# Altium schematic sheet Sheet2.SchDoc: =GlobalProjectName
size 209 x 297 mm; ApprovedBy: Утвердил; CheckedBy: Проверил; Author: Разработал; SheetNumber: 51; SheetTotal: 66; PageSetup: Record=PageOptions|CenterHorizontal=True|CenterVertical=True|PrintScale=1.00|XCorrection=1.00|YCorrection=1.00|PrintKind=1|BorderSize=5000000|LeftOffset=0|BottomOffset=0|Orientation=2|PaperLength=1000|PaperWidth=1000|Scale=100|PaperSource=15|PrintQuality=1200|MediaType=1|DitherType=10|PaperKind=A3|PrintScaleMode=1; Weight: -; ScaleFactor: -; NormInspection: Норм.Контр.
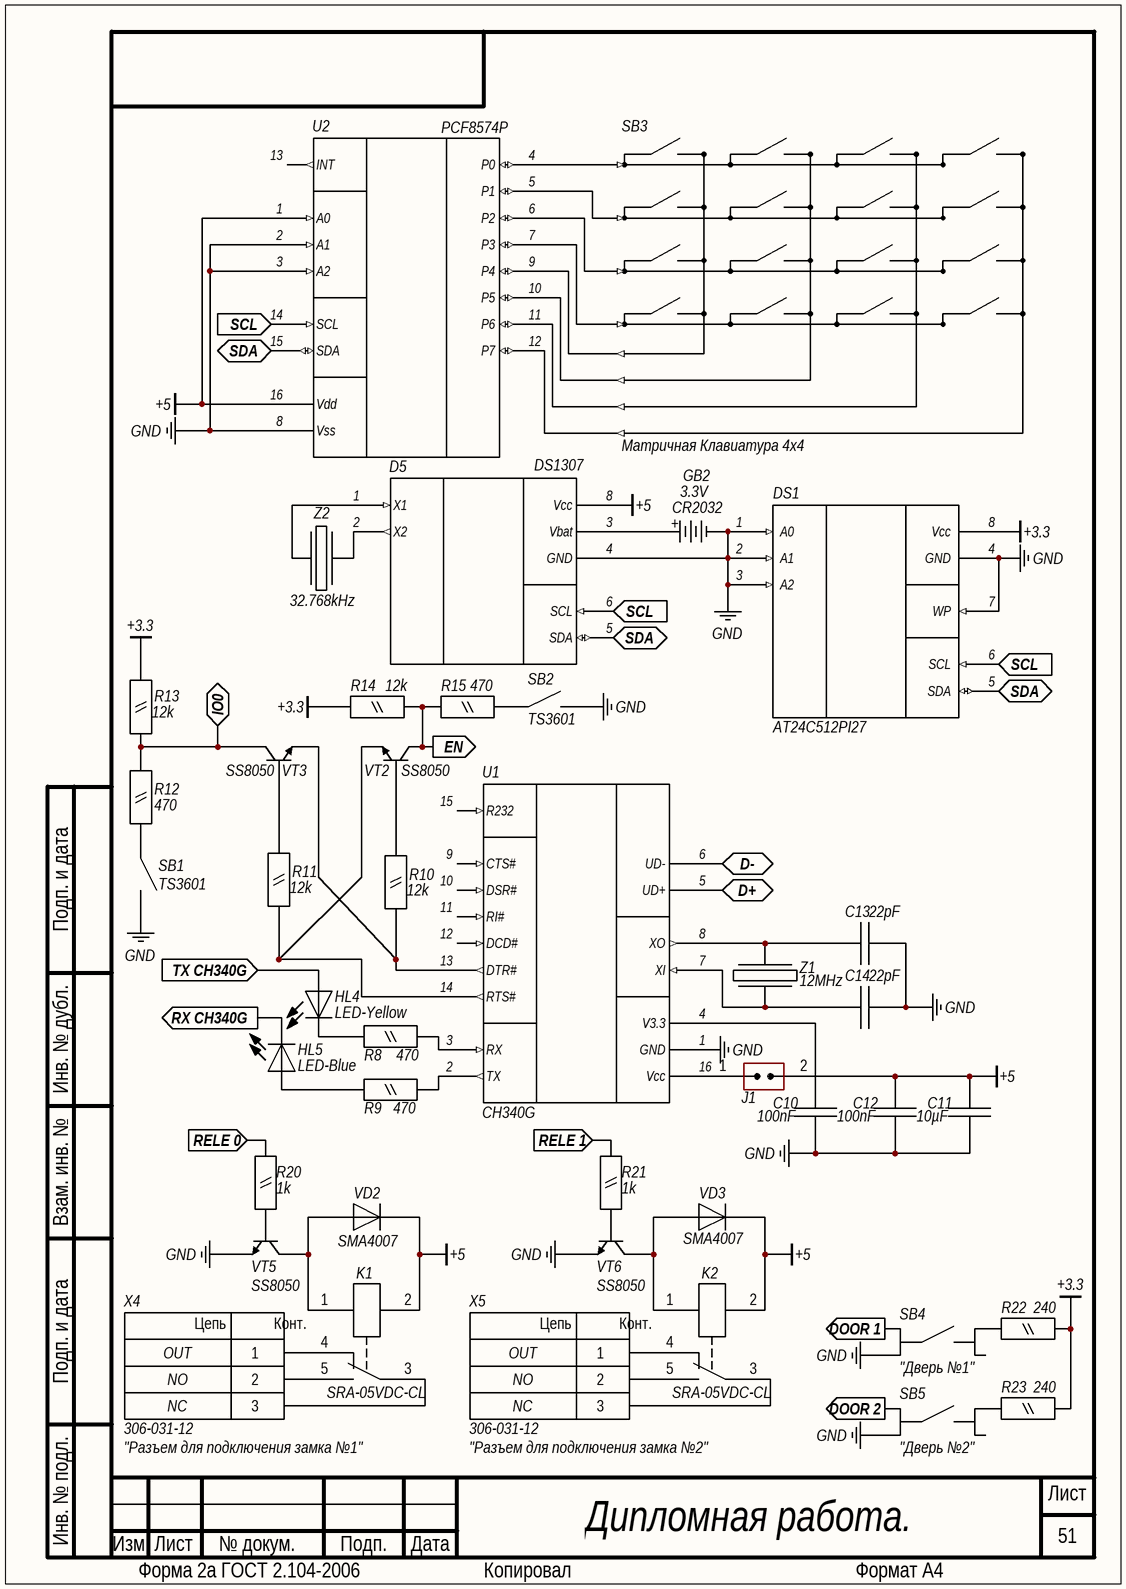
[diagram p0: Sheet2.SchDoc]

## Parts
D5  DS1307  [U DIP-8]
DS1  AT24C512PI27  [U DIP-8]
GB2  3.3V  Case: CR2032  [GB CR2032]
HL4  LED-Yellow  [HL LED SMD 0805]
HL5  LED-Blue  [HL LED SMD 0805]
J1  (no value)  [CON: PLS-2]
K1  SRA-05VDC-CL  [K SRA-05VDC-CL]
K2  SRA-05VDC-CL  [K SRA-05VDC-CL]
R8  470  [R SMD 0805]
R9  470  [R SMD 0805]
R10  12k  [R SMD 0805]
R11  12k  [R SMD 0805]
R12  470  [R SMD 0805]
R13  12k  [R SMD 0805]
R14  12k  [R SMD 0805]
R15  470  [R SMD 0805]
R20  1k  [R SMD 0805]
R21  1k  [R SMD 0805]
R22  240  [R SMD 0805]
R23  240  [R SMD 0805]
SB1  TS3601  [SB 3.5x6]
SB2  TS3601  [SB 3.5x6]
SB3  Матричная Клавиатура 4x4  [X PLS-8]
SB4  "Дверь №1"  [X 301-031-12]
SB5  "Дверь №2"  [X 301-031-12]
U1  CH340G  [U SOIC-16]
U2  PCF8574P  [U DIP-16]
VD2  SMA4007  [VD DO-214AC]
VD3  SMA4007  [VD DO-214AC]
VT2  SS8050  [U SOT-23-3]
VT3  SS8050  [U SOT-23-3]
VT5  SS8050  [U SOT-23-3]
VT6  SS8050  [U SOT-23-3]
X4  306-031-12  CommentText: "Разъем для подключения замка №1"  [X 301-031-12]
X5  306-031-12  CommentText: "Разъем для подключения замка №2"  [X 301-031-12]
Z1  12MHz  [Z HC-49]
Z2  32.768kHz  [Z DT-26]
С10  100nF  [C SMD 0805]
С11  10µF  [C SMD 0805]
С12  100nF  [C SMD 0805]
С13  22pF  [C SMD 0805]
С14  22pF  [C SMD 0805]

## Ports
D+ (bidir), D- (bidir), DOOR 1 (out), DOOR 2 (out), EN (out), IO0 (bidir), RELE 0 (in), RELE 1 (in), RX CH340G (out), SCL (in), SDA (bidir), TX CH340G (in)

## Nets
+3.3: DS1.8(Vcc) R13.2 R14.2 R22.2 R23.2
+5: D5.8(Vcc) J1.2(IN) K1.2 K2.2 U2.1(A0) U2.16(Vdd) VD2.2 VD3.2 С11.2 С12.2
GND: D5.4(GND) DS1.1(A0) DS1.2(A1) DS1.3(A2) DS1.4(GND) DS1.7(WP) GB2.1(-) SB1.2 SB2.2 SB4.2 SB5.2 U1.1(GND) U2.2(A1) U2.3(A2) U2.8(Vss) VT5.1(E) VT6.1(E) С10.1 С11.1 С12.1 С13.2 С14.2
D+: U1.5(UD+) ; port D+
D-: U1.6(UD-) ; port D-
DOOR 1: SB4.1 ; port DOOR 1
DOOR 2: SB5.1 ; port DOOR 2
EN: R14.1 R15.1 VT2.3(C) ; port EN
IO0: R12.1 R13.1 VT3.3(C) ; port IO0
RELE 0: R20.1 ; port RELE 0
RELE 1: R21.1 ; port RELE 1
RX CH340G: HL5.2 ; port RX CH340G
SCL: D5.6(SCL) DS1.6(SCL) U2.14(SCL) ; port SCL
SDA: D5.5(SDA) DS1.5(SDA) U2.15(SDA) ; port SDA
TX CH340G: HL4.1 ; port TX CH340G
NetD5_1: D5.1(X1) Z2.2
NetD5_2: D5.2(X2) Z2.1
NetD5_3: D5.3(Vbat) GB2.2(+)
NetHL4_2: HL4.2 R8.1
NetHL5_1: HL5.1 R9.1
NetJ1_1: J1.1(IN) U1.16(Vcc)
NetK1_1: K1.1 VD2.1 VT5.3(C)
NetK1_3: K1.3 X4.3
NetK1_4: K1.4 X4.1
NetK1_5: K1.5 X4.2
NetK2_1: K2.1 VD3.1 VT6.3(C)
NetK2_3: K2.3 X5.3
NetK2_4: K2.4 X5.1
NetK2_5: K2.5 X5.2
NetR8_2: R8.2 U1.3(RX)
NetR9_2: R9.2 U1.2(TX)
NetR10_1: R10.1 U1.13(DTR#) VT3.1(E)
NetR10_2: R10.2 VT2.2(B)
NetR11_1: R11.1 U1.14(RTS#) VT2.1(E)
NetR11_2: R11.2 VT3.2(B)
NetR12_2: R12.2 SB1.1
NetR15_2: R15.2 SB2.1
NetR20_2: R20.2 VT5.2(B)
NetR21_2: R21.2 VT6.2(B)
NetR22_1: R22.1 SB4.3
NetR23_1: R23.1 SB5.3
NetSB3_1: SB3.1 U2.4(P0)
NetSB3_2: SB3.2 U2.5(P1)
NetSB3_3: SB3.3 U2.6(P2)
NetSB3_4: SB3.4 U2.7(P3)
NetSB3_5: SB3.5 U2.9(P4)
NetSB3_6: SB3.6 U2.10(P5)
NetSB3_7: SB3.7 U2.11(P6)
NetSB3_8: SB3.8 U2.12(P7)
NetU1_4: U1.4(V3.3) С10.2
NetU1_7: U1.7(XI) Z1.1 С14.1
NetU1_8: U1.8(XO) Z1.2 С13.1

Not connected (* = marked no-connect by the designer): SB4 4; SB5 4; U1 9(CTS#) 10(DSR#) 11(RI#) 12(DCD#) 15(R232); U2 13(INT)

## Notes on the sheet
- Дипломная работа.
- Подп. и дата
- Инв. № дубл.
- Взам. инв. №
- Инв. № подл.
- Изм.
- Лист
- № докум.
- Подп.
- Дата
- Форма 2а ГОСТ 2.104-2006
- Копировал
- Формат А4
- (in symbol Винтовой Клеммник 3 Pin) Цепь; Конт.

## Library data of the parts
D5 = DS1307: Часы реального времени.; Manufacturer: Dallas Semiconductor; ComponentLink1Description: HelpURL; ComponentLink1URL: *; ComponentLink2Description: Datasheet; ComponentLink2URL: https://www.sparkfun.com/datasheets/Components/DS1307.pdf; Case: *; Model: DS1307; ComponentLink3Description: Store; ComponentLink3URL: https://aliexpress.ru/item/33022793738.html?spm=a2g0s.9042311.0.0.4d6533edTBBY1Q
DS1 = AT24C: Перезаписываемая постоянная память.; Manufacturer: Atmel; Device Revision: B; Memory Size: 512 kbit; Case: PDIP-8; Model: AT24C512PI27; ComponentLink1Description: Datasheet; ComponentLink1URL: http://ww1.microchip.com/downloads/en/devicedoc/atmel-8720-seeprom-at24c512c-datasheet.pdf; ComponentLink2Description: HelpURL; ComponentLink2URL: https://www.microchip.com/wwwproducts/en/AT24C512C; ComponentLink3Description: Store; ComponentLink3URL: https://aliexpress.ru/item/32598383117.html?spm=a2g0s.9042311.0.0.3da233edDDspR7
GB2 = Батарея: Voltage: 3.3V; Model: *; Manufacturer: *; Capacity: *; ComponentLink1Description: Store; ComponentLink1URL: *; ComponentLink2Description: HelpURL; ComponentLink2URL: *; ComponentLink3Description: Datasheet; ComponentLink3URL: *
HL4 = Светодиод: Manufacturer: Taiwan Oasis Technology Co., Ltd; Color: Yellow; Case: 0805; Model: LED-Yellow; ComponentLink1Description: Datasheet; ComponentLink1URL: https://static.chipdip.ru/lib/736/DOC002736052.pdf; ComponentLink2Description: HelpURL; ComponentLink2URL: *; ComponentLink3Description: Store; ComponentLink3URL: https://www.chipdip.ru/product/to-2013bc-myf
HL5 = Светодиод: Manufacturer: Taiwan Oasis Technology Co., Ltd; Color: Blue; Case: 0805; Model: LED-Blue; ComponentLink1Description: Datasheet; ComponentLink1URL: https://static.chipdip.ru/lib/736/DOC002736052.pdf; ComponentLink2Description: HelpURL; ComponentLink2URL: *; ComponentLink3Description: Store; ComponentLink3URL: https://www.chipdip.ru/product/to-2013bc-bf
J1 = Jumper_single: CommentText: "Перемычка"
K1 K2 = Реле SRD-05VDC: Manufacturer: Ningbo Songle; TypeRelay: Electromechanics relay; VoltageMax: 250VAC; VoltageControlCoil: 5VDC; MaxCurrent: 20A; Temperature: -40...+85°C; Model: SRA-05VDC-CL; ComponentLink1Description: Store; ComponentLink1URL: https://aliexpress.ru/item/32836198919.html?spm=a2g0s.9042311.0.0.4d6533edTBBY1Q; ComponentLink2Description: Datasheet; ComponentLink2URL: https://www.circuitbasics.com/wp-content/uploads/2015/11/SRD-05VDC-SL-C-Datasheet.pdf; ComponentLink3Description: HelpURL; ComponentLink3URL: *
R8 R9 R12 R15 = Резистор 0.125 Вт: R; Model: RC0805FR-07470RL; Power: 0.125; Case: 0805; Manufacturer: *; ComponentLink1Description: Datasheet; ComponentLink1URL: *; ComponentLink2Description: HelpURL; ComponentLink2URL: *; Value: 470; ComponentLink3Description: Store; ComponentLink3URL: https://www.chipdip.ru/product0/9000079478
R10 R11 R13 R14 = Резистор 0.125 Вт: R; Model: RC0805FR-0712KL; Power: 0.125; Case: 0805; Manufacturer: *; ComponentLink1Description: Datasheet; ComponentLink1URL: *; ComponentLink2Description: HelpURL; ComponentLink2URL: *; Value: 12k; ComponentLink3Description: Store; ComponentLink3URL: https://www.chipdip.ru/product0/9000079516
R20 R21 = Резистор 0.125 Вт: R; Model: RC0805FR-071KL; Power: 0.125; Case: 0805; Manufacturer: *; ComponentLink1Description: Datasheet; ComponentLink1URL: *; ComponentLink2Description: HelpURL; ComponentLink2URL: *; Value: 1k; ComponentLink3Description: Store; ComponentLink3URL: https://www.chipdip.ru/product0/9000079486
R22 R23 = Резистор 0.125 Вт: R; Model: RC0805JR-07240RL; Power: 0.125; Case: 0805; Manufacturer: *; ComponentLink1Description: Datasheet; ComponentLink1URL: *; ComponentLink2Description: HelpURL; ComponentLink2URL: *; Value: 240; ComponentLink3Description: Store; ComponentLink3URL: https://www.chipdip.ru/product0/834986419
SB1 SB2 = Кнопка: Manufacturer: KLS electronic co ltd; ComponentLink1Description: Store; ComponentLink1URL: https://www.chipdip.ru/product/kls7-ts3601-4.3-180-tc-0120; ComponentLink2Description: Datasheet; ComponentLink2URL: https://static.chipdip.ru/lib/551/DOC001551910.pdf; ComponentLink3Description: HelpURL; ComponentLink3URL: *; Model: TS3601; Size: 3.5x6x4.3
SB3 = Матричная Клавиатура 4x4: SB; ComponentLink1Description: Store; ComponentLink1URL: https://aliexpress.ru/item/32874565775.html?spm=a2g0s.9042311.0.0.264d33edwiJORy
SB4 SB5 = Кнопка (2-х парная): SB; ComponentLink1Description: Store; ComponentLink1URL: *; ComponentLink2Description: Datasheet; ComponentLink2URL: *; ComponentLink3Description: HelpURL; ComponentLink3URL: *; Model: *; Size: *; Manufacturer: *
U1 = CH340G: Преобразователя интерфейса USB в UART.; Manufacturer: Nanjing Qinheng Microelectronics Co. Ltd.; Case: SOP-16; Model: CH340G; ComponentLink1Description: HelpURL; ComponentLink1URL: http://mypractic.ru/mikrosxema-ch340g-preobrazovatel-interfejsa-usb-v-uart-most-usb-uart-xarakteristiki-usloviya-ekspluatacii-tipovye-sxemy-vklyucheniya.html; ComponentLink2Description: Datasheet; ComponentLink2URL: http://www.wch-ic.com/products/CH340.html?from=search&q=eyJpdiI6InNwMEdrWnhCbzlTczZhZUM2cncxVHc9PSIsInZhbHVlIjoia0FTMDlncDFNZ29zQmJ2ZGJZOTBCZz09IiwibWFjIjoiZGE4NTAzZGQ0ZWQzNzFmMTZkZWFhMWYwOTExNzExNWI5YjhlMzUwMjE3NzYxMzc5MWI2ZmFmZTVlMDQ3ZDAwZiJ9; ComponentLink3Description: Store; ComponentLink3URL: https://aliexpress.ru/item/32836074859.html?spm=a2g0s.9042311.0.0.264d33edvcXNXs
U2 = PCF8574: IIC расширитель.; Model: PCF8574P; Manufacturer: *; Case: *; ComponentLink1Description: Datasheet №1; ComponentLink1URL: https://www.nxp.com/docs/en/data-sheet/PCF8574_PCF8574A.pdf; ComponentLink2Description: Datasheet №2; ComponentLink2URL: http://www.ti.com/lit/ds/symlink/pcf8574.pdf; ComponentLink3Description: HelpURL; ComponentLink3URL: *; ComponentLink4Description: Store; ComponentLink4URL: https://aliexpress.ru/item/4000480743714.html?spm=a2g0s.9042311.0.0.264d33edUHMLcH
VD2 VD3 = Диод: VD; Case: SMA; Manufacturer: *; Model: SMA4007; ComponentLink1Description: Datasheet; ComponentLink1URL: *; ComponentLink2Description: HelpURL; ComponentLink2URL: *; ComponentLink3Description: Store; ComponentLink3URL: https://www.chipdip.ru/product/sma4007
VT2 VT3 VT5 VT6 = Биполярный Транзистор: Manufacturer: Hottech; Model: SS8050; Case: SOT-23-3; ComponentLink1Description: Datasheet; ComponentLink1URL: https://static.chipdip.ru/lib/210/DOC005210683.pdf; ComponentLink2Description: HelpURL; ComponentLink2URL: *; ComponentLink3Description: Store; ComponentLink3URL: https://www.chipdip.ru/product/ss8050-hottech
X4 X5 = Винтовой Клеммник 3 Pin: TypeConnector: Terminal connector; VoltageMax: 300VAC; Pitch: 3.5mm; CurrentMax: 10A; Multichannel: 3pin; Text3: NC; Text2: NO; Text1: OUT; Manufacturer: *; Model: 306-031-12
Z1 = Кварцевый Резонатор: Model: HC-49; Case: *; Manufacturer: *; Frequency: 12MHz; ComponentLink1Description: Store; ComponentLink1URL: https://aliexpress.ru/item/32905911610.html?spm=a2g0s.9042311.0.0.264d33edzA8MIe; ComponentLink2Description: Datasheet; ComponentLink2URL: *; ComponentLink3Description: HelpURL; ComponentLink3URL: *
Z2 = Кварцевый Резонатор: Case: DT-26; Model: *; Manufacturer: *; Frequency: 32.768kHz; ComponentLink1Description: Store; ComponentLink1URL: https://www.chipdip.ru/product/32768hz-2x6mm; ComponentLink2Description: Datasheet; ComponentLink2URL: *; ComponentLink3Description: HelpURL; ComponentLink3URL: *
С10 С12 = Конденсатор: Manufacturer: Murata Manufacturing; Model: GRM21BR71E104KA01L; Voltage: 25; Case: 0805; ComponentLink1Description: Datasheet; ComponentLink1URL: https://static.chipdip.ru/lib/428/DOC005428493.pdf; ComponentLink2Description: HelpURL; ComponentLink2URL: *; Value: 100nF; ComponentLink3Description: Store; ComponentLink3URL: https://www.chipdip.ru/product/grm21br71e104ka01l
С11 = Конденсатор: C; Manufacturer: Murata Manufacturing; Model: GRM21BR61C106KE15L; Voltage: 16; Case: 0805; ComponentLink1Description: Datasheet; ComponentLink1URL: https://static.chipdip.ru/lib/428/DOC005428493.pdf; ComponentLink2Description: HelpURL; ComponentLink2URL: *; Value: 10µF; ComponentLink3Description: Store; ComponentLink3URL: https://www.chipdip.ru/product/grm21br61c106ke15l
С13 С14 = Конденсатор: Model: MLCC22pFNPO50V5%0805; Voltage: 50; Case: 0805; Manufacturer: *; ComponentLink1Description: Datasheet; ComponentLink1URL: *; ComponentLink2Description: HelpURL; ComponentLink2URL: *; Value: 22pF; ComponentLink3Description: Store; ComponentLink3URL: https://www.chipdip.ru/product0/29844